# EAGLE design akabeacon_circle_MDBT42_type1 (EAGLE 9.6.2)
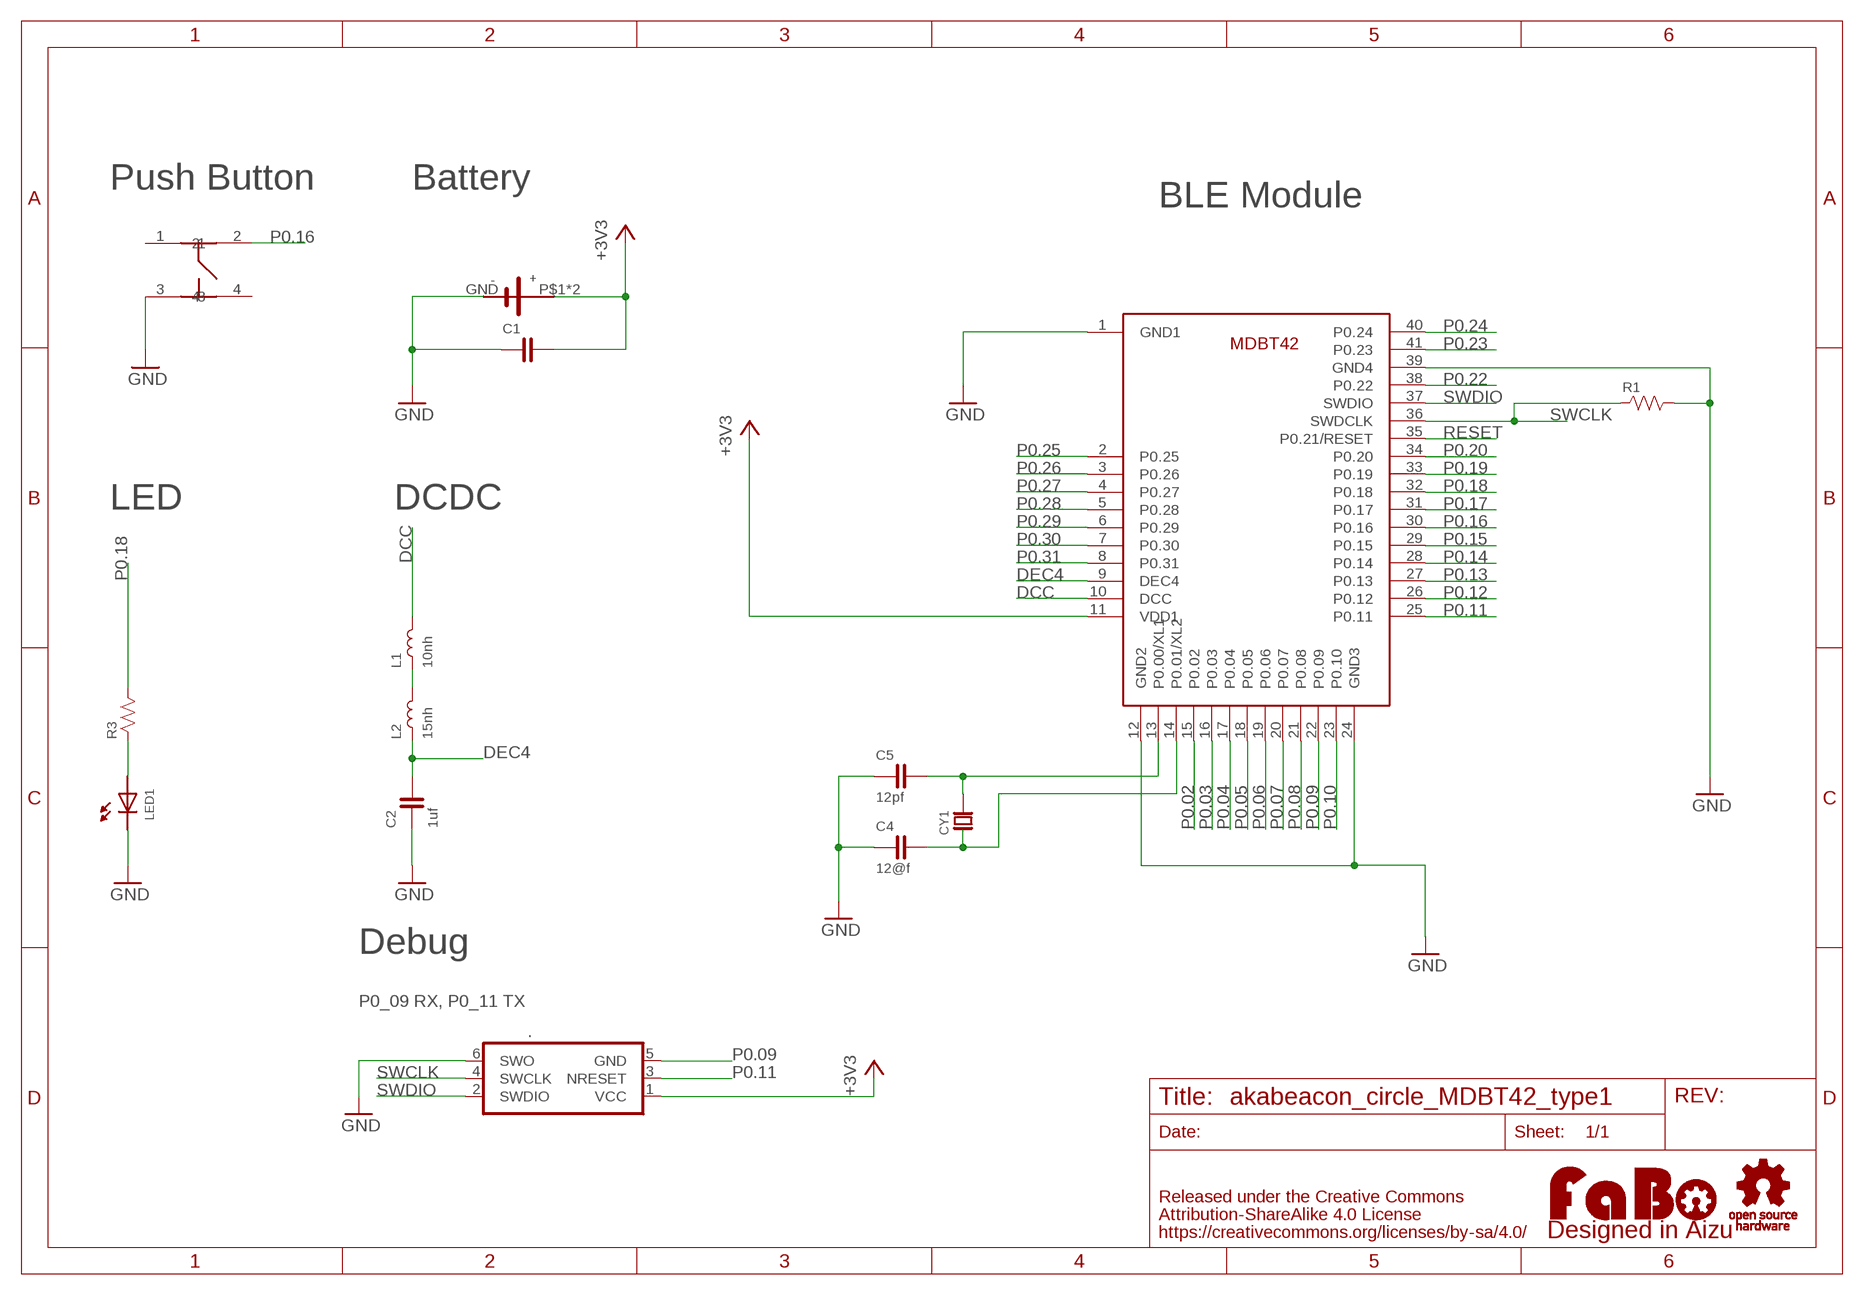
[diagram p0: schematic, sheet 1]

## Parts
.  TC2030-IDC-NL  [TC2030-IDC-NL]
C1  CAPACITOR-0603  [0603]
C2  1uf  CAPACITOR-0603  [0603]
C4  12@f  CAPACITOR-0603  [0603]
C5  12pf  CAPACITOR-0603  [0603]
CY1  CRYSTAL-ABS07  [ABRACON-ABS07-32.768KHZ]
L1  10nh  INDUCTOR-0603  [0603]
L2  15nh  INDUCTOR-0603  [0603]
LED1  LED-0603  [0603]
R1  RESISTOR-0603  [0603]
R3  RESISTOR-0603  [0603]
U$1  LOGO_OSHW-M_BOTTOM  [LOGO_OSHW_M_BOTTOM]
U$2  RAYTAC-MDBT42  [RAYTAC-MDBT42]
U$3  CIRCLE-TYPE2  [CIRCLE-TYPE2-TC2030]
U$4  LOGO_FABO-M_BOTTOM  [LOGO_FABO_MS_BOTTOM]
U$5  SWICTH-4P(KMR2)  [SWITCH-4P(KMR2)]

## Nets
+3V3: ..1(VCC) C1.2 U$2.11(VDD1) U$3.P$1(VCC) U$3.P$2(VCC)
DCC: L1.2 U$2.10(DCC)
DEC4: C2.2 L2.1 U$2.9(DEC4)
GND: ..6(SWO) C1.1 C2.1 C4.1 C5.1 LED1.CATHODE R1.2 U$2.1(GND1) U$2.12(GND2) U$2.24(GND3) U$2.39(GND4) U$3.GND U$5.3
N$1: LED1.ANODE R3.1
N$2: L1.1 L2.2
N$7: C5.2 CY1.P$2 U$2.13(P0.00/XL1)
N$8: C4.2 CY1.P$1 U$2.14(P0.01/XL2)
P0.02: U$2.15(P0.02)
P0.03: U$2.16(P0.03)
P0.04: U$2.17(P0.04)
P0.05: U$2.18(P0.05)
P0.06: U$2.19(P0.06)
P0.07: U$2.20(P0.07)
P0.08: U$2.21(P0.08)
P0.09: ..5(GND) U$2.22(P0.09)
P0.10: U$2.23(P0.10)
P0.11: ..3(NRESET) U$2.25(P0.11)
P0.12: U$2.26(P0.12)
P0.13: U$2.27(P0.13)
P0.14: U$2.28(P0.14)
P0.15: U$2.29(P0.15)
P0.16: U$2.30(P0.16) U$5.2
P0.17: U$2.31(P0.17)
P0.18: R3.2 U$2.32(P0.18)
P0.19: U$2.33(P0.19)
P0.20: U$2.34(P0.20)
P0.22: U$2.38(P0.22)
P0.23: U$2.41(P0.23)
P0.24: U$2.40(P0.24)
P0.25: U$2.2(P0.25)
P0.26: U$2.3(P0.26)
P0.27: U$2.4(P0.27)
P0.28: U$2.5(P0.28)
P0.29: U$2.6(P0.29)
P0.30: U$2.7(P0.30)
P0.31: U$2.8(P0.31)
RESET: U$2.35(P0.21/RESET)
SWCLK: ..4(SWCLK) R1.1 U$2.36(SWDCLK)
SWDIO: ..2(SWDIO) U$2.37(SWDIO)
Unconnected: U$5.1 U$5.4

## Notes on the sheet
- Push Button | Battery
- BLE Module
- LED | DCDC
- Debug
- P0_09 RX, P0_11 TX

## Library data of the parts
. = TagConnect:TC2030-IDC: Tag-Connect In Circuit Programming & Debug Cable 6 Pin http://www.tag-connect.com
C1 C2 C4 C5 = FaBo-Capacitor:CAPACITOR: CAPACITOR
CY1 = FaBo-Crystal:CRYSTAL
L1 L2 = FaBo-Inductor:INDUCTOR: RESISTOR
LED1 = FaBo-LED:LED
R1 R3 = FaBo-Resistors:RESISTOR: RESISTOR
U$1 = FaBo-Logo:LOGO_OSHW
U$2 = FaBo-BT:RAYTAC-MDBT42
U$3 = FaBo-Template:CIRCLE-TYPE2
U$4 = FaBo-Logo:LOGO_FABO
U$5 = gclue-test:SWICTH-4P(KMR2)

## Board
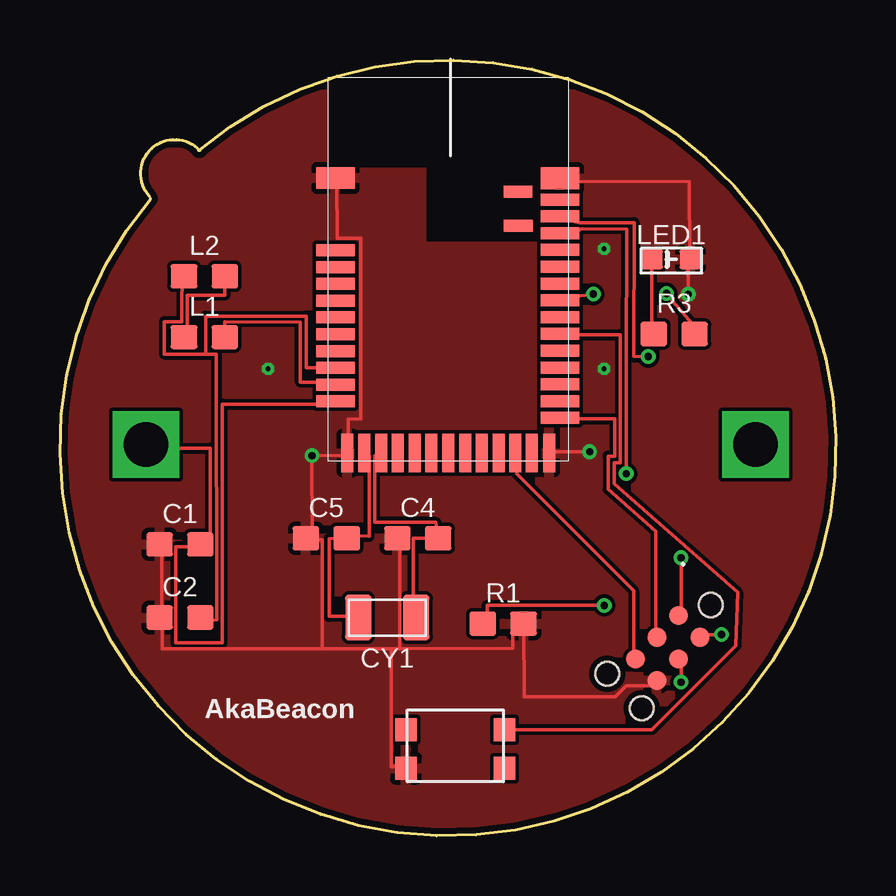
[diagram p1: board, top side]
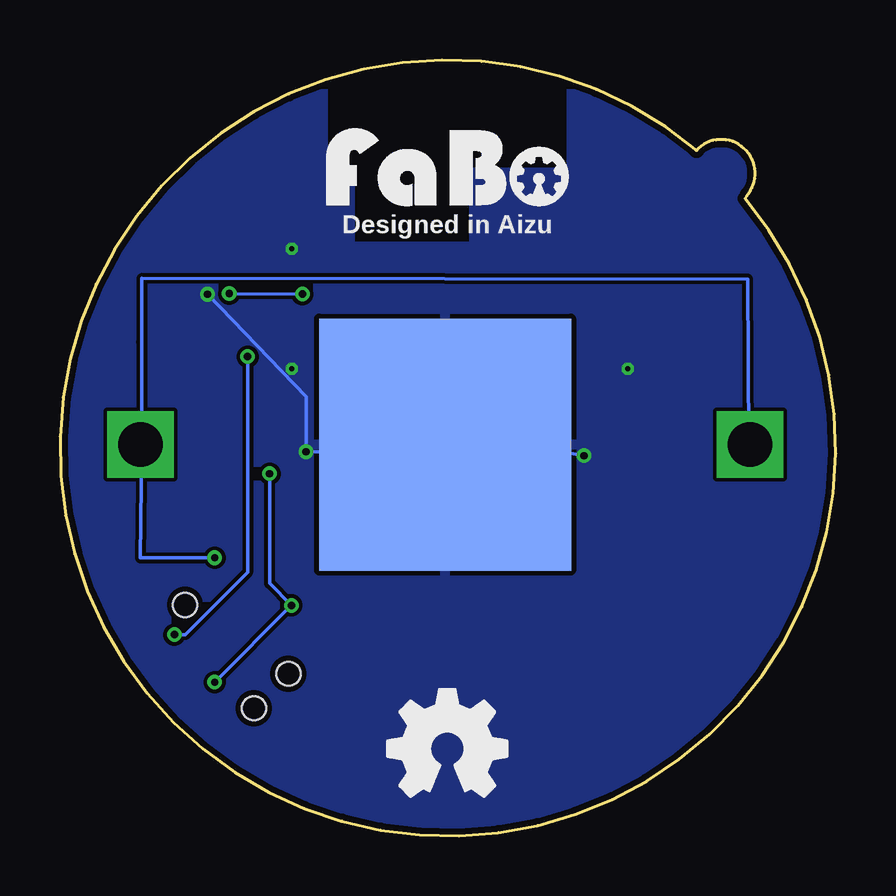
[diagram p2: board, bottom side, seen from below]

Size 32.32 x 32.32 mm. Coordinates in mm from the lower left corner, seen from the top.
Copper layers (1*16): Top 0.035mm / dielectric 1.6mm / Bottom 0.035mm
Design rules "PCBway": minimum track width 6mil, minimum drill 12mil, track to track 6mil, track to pad 6mil, pad to pad 6mil, via to via 6mil, smd to smd 6mil, copper to edge 10mil, drill to drill 10mil, minimum pad ring 10mil, minimum via ring 6mil, stop-mask expansion 2mil, vias tented up to drill 100mil, thermal gap 8mil

### Footprints (pad centres in the part's own frame; a part is rotated, then mirrored left to right if it is on the bottom)
TC2030-IDC-NL = smd 0.787 x 0.787: 1 -1.27,-0.635; 2 -1.27,0.635; 3 0,-0.635; 4 0,0.635; 5 1.27,-0.635; 6 1.27,0.635 | hole 0.991: -2.54,0; 2.54,1.016; 2.54,-1.016
0603 = smd 1.1 x 1: 1 -0.85,0; 2 0.85,0
ABRACON-ABS07-32.768KHZ = smd 1.1 x 1.9: P$1 -1.2,0; P$2 1.2,0
0603' = smd 0.9 x 0.8: ANODE -0.8,0; CATHODE 0.8,0
RAYTAC-MDBT42 = smd 1.6 x 0.9: 1 -4.7,3.8; 39 4.65,3.79 | smd 1.6 x 0.5: 2 -4.7,0.79; 3 -4.7,0.09; 4 -4.7,-0.61; 5 -4.7,-1.31; 6 -4.7,-2.01; 7 -4.7,-2.71; 8 -4.7,-3.41; 9 -4.7,-4.11; 10 -4.7,-4.81; 11 -4.7,-5.51; 25 4.65,-6.2; 26 4.65,-5.5; 27 4.65,-4.8; 28 4.65,-4.1; 29 4.65,-3.4; 30 4.65,-2.7; 31 4.65,-2; 32 4.65,-1.3; 33 4.65,-0.6; 34 4.65,0.1; 35 4.65,0.8; 36 4.65,1.5; 37 4.65,2.2; 38 4.65,2.9 | smd 0.5 x 1.6: 12 -4.2,-7.66; 13 -3.5,-7.66; 14 -2.8,-7.66; 15 -2.1,-7.66; 16 -1.4,-7.66; 17 -0.7,-7.66; 18 0,-7.66; 19 0.7,-7.66; 20 1.4,-7.66; 21 2.1,-7.66; 22 2.8,-7.66; 23 3.48,-7.66; 24 4.2,-7.66 | smd 1.2 x 0.5: 40 2.91,3.23; 41 2.92,1.81
CIRCLE-TYPE2-TC2030 = smd 10.5 x 10.5 bottom: GND 0,0 | drill 1.85 square: P$1 -12.7,0; P$2 12.7,0
SWITCH-4P(KMR2) = smd 0.9 x 0.95: 1 -1,0; 2 3.1,0; 3 -1,-1.6; 4 3.1,-1.6

### Placement (x,y rotation side)
.  25.32,7.82 225 top
C1  5,12.14 0 top
C2  5,9.09 0 top
C4  14.91,12.4 0 top
C5  11.1,12.4 0 top
CY1  13.64,9.09 180 top
L1  6.02,20.78 0 top
L2  6.02,23.32 0 top
LED1  [0603']  25.47,24.02 0 top
R1  18.46,8.84 0 top
R3  25.59,20.91 0 top
U$1  16.18,3.63 0 top
U$2  16.18,23.61 0 top
U$3  16.28,16.3 0 top
U$4  16.18,25.86 0 top
U$5  15.42,4.41 0 top

### Tracks (layer width: path | path; a pad name or v marks a point on that pad's centre or on a via)
+3V3  (via drill 0.3)
  Top 0.152: v25.88,11.58 25.88,9.3 ..1 | U$3.P$1 3.63,16.15 6.27,16.15 6.26,12.15 C1.2 5.61,12.04 4.82,12.04 4.83,8.04 4.99,8.04 6.53,8.04 6.76,8.04 6.76,11.56 6.76,17.98 11.4,17.98 U$2.11
  Bottom 0.152: v25.88,11.58 28.98,11.58 28.93,16.15 U$3.P$2 28.93,16.31 28.93,20.57 28.92,23.23 3.68,23.2 3.63,16.31 U$3.P$1
DCC
  Top 0.152: L1.2 6.86,21.42 10.01,21.41 10.02,18.9 11.4,18.9 U$2.10
DEC4
  Top 0.152: 4.35,20.07 4.35,20.27 4.35,21.42 5.08,21.42 5.08,21.93 5.08,23.44 L2.1 | 4.35,20.07 6.52,20.07 6.53,9 5.81,8.98 5.76,9.14 C2.2 | 4.35,20.07 6.07,20.07 6.07,21.34 6.06,21.65 10.25,21.65 10.26,19.51 11.4,19.51 U$2.9
GND  (via drill 0.2, 0.3)
  Top 0.152: U$2.39 20.85,27.28 26.22,27.26 26.23,24.05 26.19,24.08 LED1.CATHODE 26.19,23.93 v26.18,22.56 | v22.07,16 20.39,16 U$2.24 | ..6 24.97,6.4 24.81,6.25 23.59,6.25 23.14,5.79 19.35,5.79 R1.2 18.87,8.84 18.86,7.81 14.16,7.8 | 14.16,7.8 13.81,7.8 13.8,2.89 13.87,2.89 14.3,2.9 U$5.3 | 14.16,7.8 14.16,9.75 14.17,10.21 14.17,12.34 C4.1 | C1.1 4.24,12.04 4.24,9.14 C2.1 4.39,8.99 4.26,8.84 4.26,8.53 4.25,7.8 6.34,7.8 10.92,7.8 | U$2.1 11.53,27.28 11.54,24.9 12.53,24.89 12.54,17.37 12.01,17.36 12.01,16 U$2.12 11.86,15.85 v10.5,15.84 10.52,12.5 C5.1 10.34,12.34 10.93,12.34 10.92,7.8 | 14.16,7.8 11.86,7.8 10.92,7.8
  Bottom 0.152: v26.18,22.56 22.07,18.29 v22.07,16 16.43,16 16.28,16.15 U$3.GND 16.13,16.15 12.16,16.15 v10.5,15.84
  other vias: 8.67,19.46 22.67,19.46 22.67,24.46
  pour Bottom: -0.33,-0.54 32.67,-0.54 32.67,33.46 -0.33,33.46
  pour Top: -0.33,-0.54 32.67,-0.54 32.67,33.46 -0.33,33.46
N$1
  Top 0.152: LED1.ANODE 24.66,23.93 24.66,21.18 24.81,21.03 R3.1
N$2
  Top 0.152: L1.1 5.31,20.88 5.31,22.52 6.87,22.53 L2.2
N$7
  Top 0.152: CY1.P$2 12.32,9.14 11.21,9.14 11.21,12.38 C5.2 11.86,12.5 12.88,12.48 12.88,15.84 U$2.13
N$8
  Top 0.152: CY1.P$1 14.91,9.14 14.73,9.8 14.73,12.39 C4.2 15.66,13.06 13.12,13.06 13.12,15.84 U$2.14
P0.09
  Top 0.152: ..5 23.9,7.47 23.9,10.21 19.02,15.09 19.02,15.85 U$2.22
P0.11
  Top 0.152: ..3 24.81,8.38 24.82,12.69 22.84,14.44 22.84,15.82 23.11,15.81 23.11,17.37 21.46,17.37 20.85,17.37 U$2.25
P0.16
  Top 0.152: U$5.2 18.57,4.42 24.66,4.42 28.17,7.93 28.24,10.14 23.8,14.05 23.11,14.65 23.09,14.67 23.09,15.54 23.35,15.54 23.33,20.88 21.61,20.88 20.85,20.88 U$2.30
P0.18  (via drill 0.3)
  Top 0.152: v25.27,22.59 26.34,21.34 26.34,21.03 R3.2 | v22.22,22.57 20.85,22.4 U$2.32
  Bottom 0.152: v22.22,22.57 v25.27,22.59
SWCLK  (via drill 0.3)
  Top 0.152: v25.88,6.4 25.88,7.32 ..4 | v22.68,9.6 17.8,9.6 17.8,8.84 R1.1 | v23.59,15.09 23.59,21.79 23.61,23.06 23.61,25.27 21.77,25.28 20.85,24.99 U$2.36
  Bottom 0.152: v25.88,6.4 v22.68,9.6 23.59,10.52 v23.59,15.09
SWDIO  (via drill 0.3)
  Top 0.152: v27.56,8.38 26.79,8.38 ..2 | v24.51,19.96 23.9,19.98 23.92,25.55 21.63,25.55 20.85,25.76 U$2.37
  Bottom 0.152: v27.56,8.38 27.1,8.38 24.51,10.97 v24.51,19.96

### Text on the board
tPlace: AkaBeacon
bPlace: Designed in Aizu